# EAGLE design TF (EAGLE 6.4)
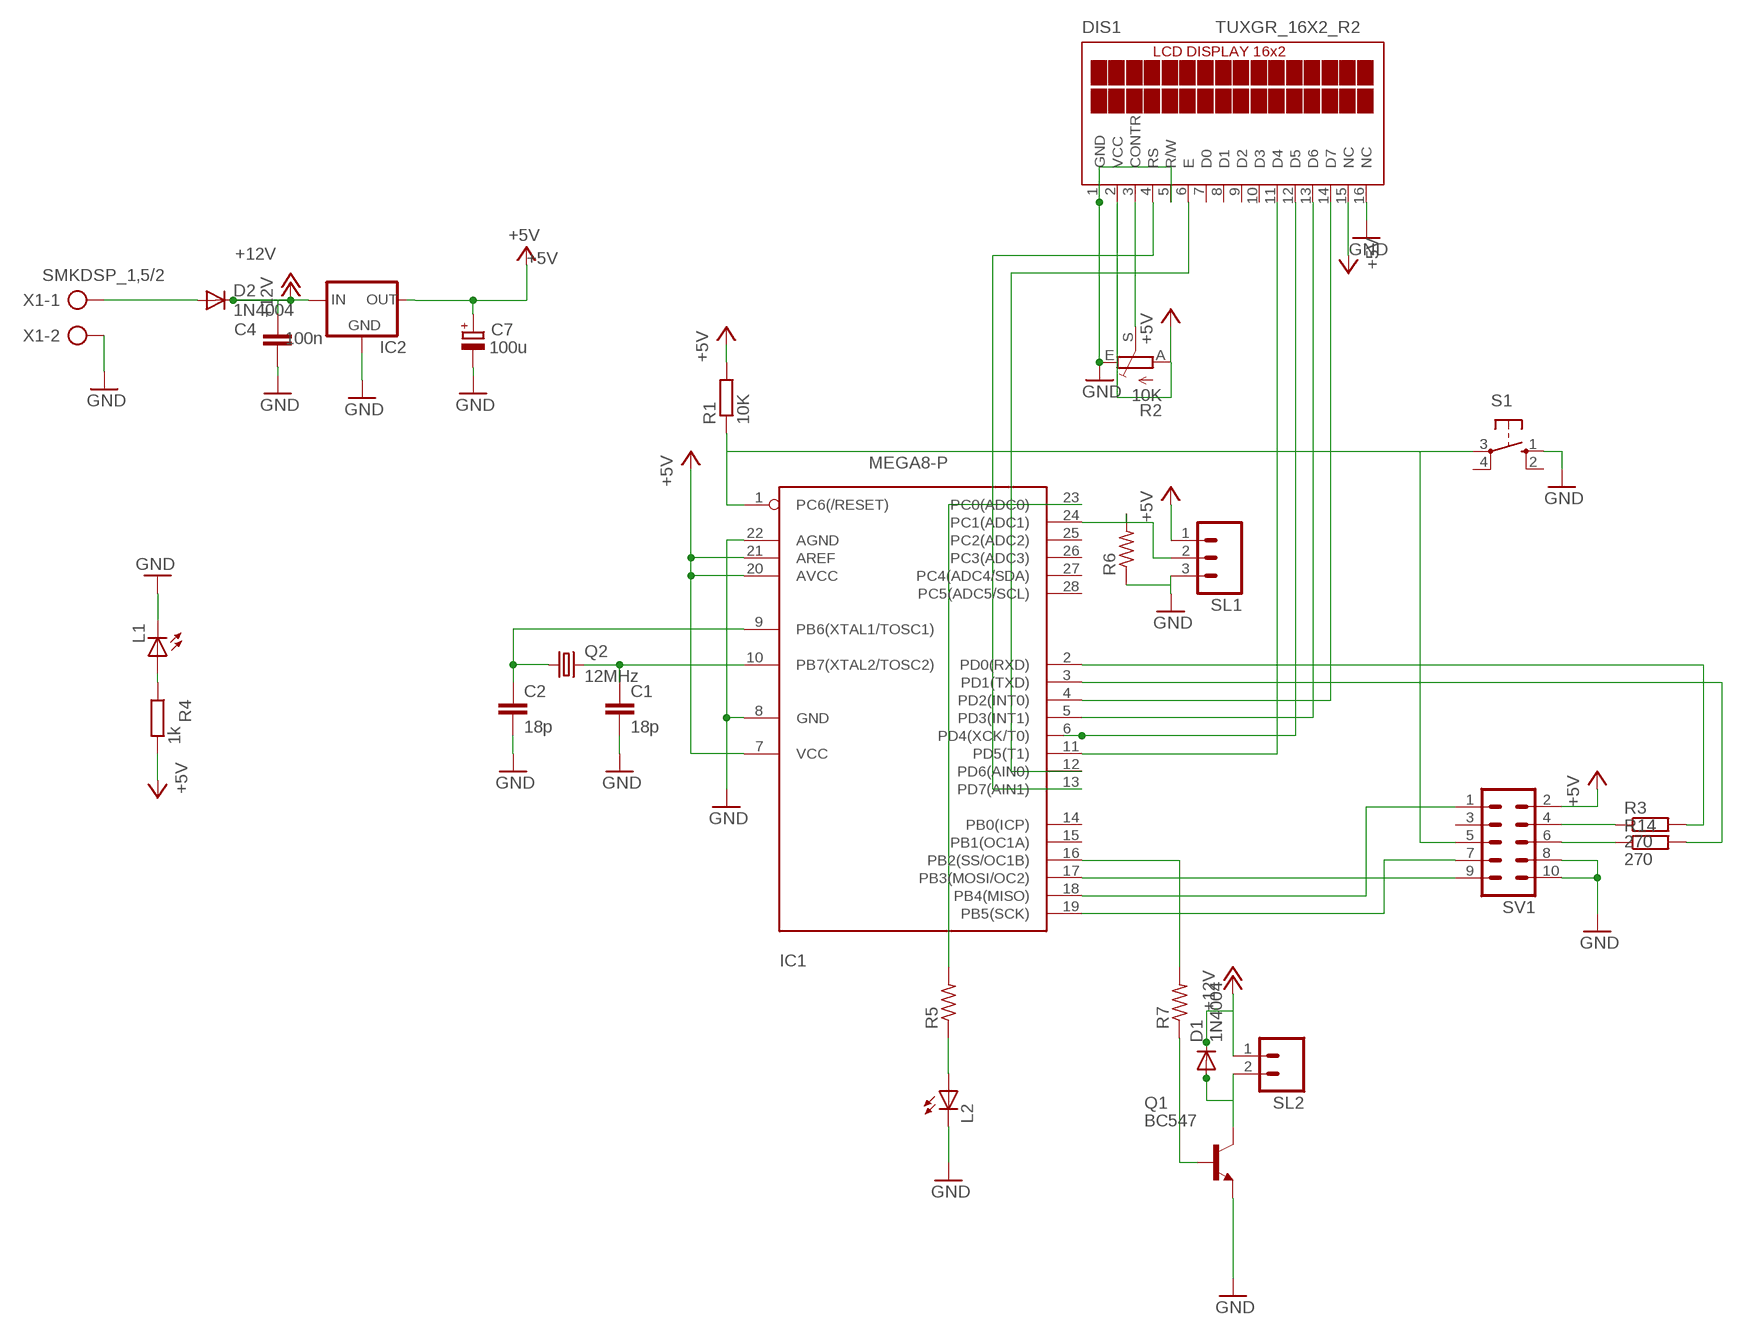
[diagram p0: schematic, sheet 1]

## Parts
C1  18p  C-EU025-024X044  [C025-024X044]
C2  18p  C-EU025-024X044  [C025-024X044]
C4  100n  C-EU025-030X050  [C025-030X050]
C7  100u  CPOL-EUE3.5-8  [E3,5-8]
D1  1N4004  [DO41-10]
D2  1N4004  [DO41-10]
DIS1  TUXGR_16X2_R2  [TUXGR_16X2_R2]
IC1  MEGA8-P  [DIL28-3]
IC2  78XXS  [78XXS]
L1  LED5MM  [LED5MM]
L2  LED5MM  [LED5MM]
Q1  BC547  [TO92]
Q2  12MHz  CRYTALHC49S  [HC49/S]
R1  10K  R-EU_0207/10  [0207/10]
R2  10K  TRIM_EU-CA6V  [CA6V]
R3  270  R-EU_0207/10  [0207/10]
R4  1k  R-EU_0207/10  [0207/10]
R5  R-US_0207/10  [0207/10]
R6  R-US_0207/10  [0207/10]
R7  R-US_0207/10  [0207/10]
R14  270  R-EU_0207/10  [0207/10]
S1  10-XX  [B3F-10XX]
SL1  M03  [03P]
SL2  M02  [02P]
SV1  ML10  [ML10]
X1  SMKDSP_1,5/2  [SMKDSP_1,5/2]

## Nets
+5V: C7.+ DIS1.2(VCC) DIS1.15(NC) IC1.7(VCC) IC1.20(AVCC) IC1.21(AREF) IC2.OUT R1.2 R2.A R4.2 SL1.1 SV1.2
+12V [power]: C4.2 D1.C D2.C IC2.IN SL2.1
GND: C1.2 C2.2 C4.1 C7.- DIS1.1(GND) DIS1.5(R/W) DIS1.16(NC) IC1.8(GND) IC1.22(AGND) IC2.GND L1.K(C) L2.K(C) Q1.1(E) R2.E R6.1 S1.1(S) SL1.3 SV1.8 SV1.10 X1.2
N$1: L1.A R4.1
N$2: DIS1.6(E) IC1.12(PD6(AIN0))
N$3: C1.1 IC1.10(PB7(XTAL2/TOSC2)) Q2.2
N$4: C2.1 IC1.9(PB6(XTAL1/TOSC1)) Q2.1
N$5: DIS1.3(CONTR) R2.S
N$6: R3.1 SV1.4
N$7: IC1.2(PD0(RXD)) R3.2
N$8: D1.A Q1.3(C) SL2.2
N$9: DIS1.13(D6) IC1.5(PD3(INT1))
N$10: DIS1.14(D7) IC1.4(PD2(INT0))
N$11: IC1.18(PB4(MISO)) SV1.1
N$12: DIS1.12(D5) IC1.6(PD4(XCK/T0))
N$13: IC1.1(PC6(/RESET)) R1.1 S1.3(P) SV1.5
N$14: DIS1.11(D4) IC1.11(PD5(T1))
N$15: IC1.17(PB3(MOSI/OC2)) SV1.9
N$16: L2.A R5.1
N$17: IC1.16(PB2(SS/OC1B)) R7.2
N$18: IC1.23(PC0(ADC0)) R5.2
N$19: IC1.24(PC1(ADC1)) R6.2 SL1.2
N$21: D2.A X1.1
N$25: IC1.3(PD1(TXD)) R14.2
N$27: R14.1 SV1.6
N$28: DIS1.4(RS) IC1.13(PD7(AIN1))
N$32: Q1.2(B) R7.1
N$34: IC1.19(PB5(SCK)) SV1.7
Unconnected: DIS1.7(D0) DIS1.8(D1) DIS1.9(D2) DIS1.10(D3) IC1.14(PB0(ICP)) IC1.15(PB1(OC1A)) IC1.25(PC2(ADC2)) IC1.26(PC3(ADC3)) IC1.27(PC4(ADC4/SDA)) IC1.28(PC5(ADC5/SCL)) S1.2(S1) S1.4(P1) SV1.3

## Library data of the parts
C1 C2 = rcl:C-EU: CAPACITOR, European symbol
C4 = resistor:C-EU: CAPACITOR, European symbol
C7 = resistor:CPOL-EU: POLARIZED CAPACITOR, European symbol
D1 D2 = diode:1N4004: DIODE general purpose rectifier, 1 A
DIS1 = display-lcd:TUXGR_16X2_R2: Tuxgraphics LCD display 16x2 characters reflective, without background light Source: tuxgr_12x2_r2.pdf; OC_FARNELL: unknown; OC_NEWARK: unknown
IC1 = atmel:MEGA8-P: MICROCONTROLLER 8 Kbytes FLASH 1 kbytes SRAM 512 bytes EEPROM USART 4-channel 10 bit ADC 2-channel 8 bit ADC Source: avr.lbr
IC2 = v-reg:78XXS: VOLTAGE REGULATOR
L1 L2 = led:LED: LED OSRAM: - CHIPLED LG R971, LG N971, LY N971, LG Q971, LY Q971, LO R971, LY R971 LH N974, LH R974 LS Q976, LO Q976, LY Q976 LO Q996 - Hyper CHIPLED LW Q18S LB Q993, LB Q99A, LB R99A - SideLED LS A670, LO A670, LY A670, LG A670, LP A670 LB A673, LV A673, LT A673, LW A673 LH A674 LY A675 LS A676, LA A676, LO A676, LY A676, LW A676 LS A679, LY A679, LG A679 - Hyper Micro SIDELED® LS Y876, LA Y876, LO Y876, LY Y876 LT Y87S - SmartLED LW L88C, LW L88S LB L89C, LB L89S, LG L890 LS L89K, LO L89K, LY L89K LS L896, LA L896, LO L896, LY L896 - TOPLED LS T670, LO T670, LY T670, LG T670, LP T670 LSG T670, LSP T670, LSY T670, LOP T670, LYG T670 LG T671, LOG T671, LSG T671 LB T673, LV T673, LT T673, LW T673 LH T674 LS T676, LA T676, LO T676, LY T676, LB T676, LH T676, LSB T676, LW T676 LB T67C, LV T67C, LT T67C, LS T67K, LO T67K, LY T67K, LW E67C LS E67B, LA E67B, LO E67B, LY E67B, LB E67C, LV E67C, LT E67C LW T67C LS T679, LY T679, LG T679 LS T770, LO T770, LY T770, LG T770, LP T770 LB T773, LV T773, LT T773, LW T773 LH T774 LS E675, LA E675, LY E675, LS T675 LS T776, LA T776, LO T776, LY T776, LB T776 LHGB T686 LT T68C, LB T68C - Hyper Mini TOPLED® LB M676 - Mini TOPLED Santana® LG M470 LS M47K, LO M47K, LY M47K Source: http://www.osram.convergy.de LUXEON: - LUMILED® LXK2-PW12-R00, LXK2-PW12-S00, LXK2-PW14-U00, LXK2-PW14-V00 LXK2-PM12-R00, LXK2-PM12-S00, LXK2-PM14-U00 LXK2-PE12-Q00, LXK2-PE12-R00, LXK2-PE12-S00, LXK2-PE14-T00, LXK2-PE14-U00 LXK2-PB12-K00, LXK2-PB12-L00, LXK2-PB12-M00, LXK2-PB14-N00, LXK2-PB14-P00, LXK2-PB14-Q00 LXK2-PR12-L00, LXK2-PR12-M00, LXK2-PR14-Q00, LXK2-PR14-R00 LXK2-PD12-Q00, LXK2-PD12-R00, LXK2-PD12-S00 LXK2-PH12-R00, LXK2-PH12-S00 LXK2-PL12-P00, LXK2-PL12-Q00, LXK2-PL12-R00 Source: www.luxeon.com KINGBRIGHT: KA-3528ASYC Source: www.kingbright.com
Q1 = transistor-npn:BC547*: NPN Transistor
Q2 = crystal:CRYTAL: CRYSTAL
R1 R4 = resistor:R-EU_: RESISTOR, European symbol
R2 = pot:TRIM_EU-: POTENTIOMETER
R3 R14 = rcl:R-EU_: RESISTOR, European symbol
R5-R7 = resistor:R-US_: RESISTOR, American symbol
S1 = switch-omron:10-XX: OMRON SWITCH; MPN: B3F-1000; OC_FARNELL: 176432; OC_NEWARK: 36M3542
SL1 = con-amp-quick:M03: AMP QUICK CONNECTOR; OC_FARNELL: unknown; OC_NEWARK: unknown
SL2 = con-amp-quick:M02: AMP QUICK CONNECTOR; OC_FARNELL: unknown; OC_NEWARK: unknown
SV1 = con-harting-ml:ML10: HARTING
X1 = con-phoenix-smkdsp:SMKDSP_1,5/2: Printklemme, Nennstrom: 17,5 A, Bemessungsspannung: 250 V, Raster: 5,0 mm Source: http://eshop.phoenixcontact.de .. 1733415.pdf; MF: FARNELL; MPN: 1733570; OC_FARNELL: 3041244; OC_NEWARK: 69C8588

## Net classes
1 power: width 0.61 mm, drill 0.508 mm, clearance 0.152 mm
2 gnd: width 0.305 mm, drill 0.508 mm, clearance 0.152 mm
3 usbvcc: width 0.508 mm, drill 0.508 mm, clearance 0.152 mm

## Board
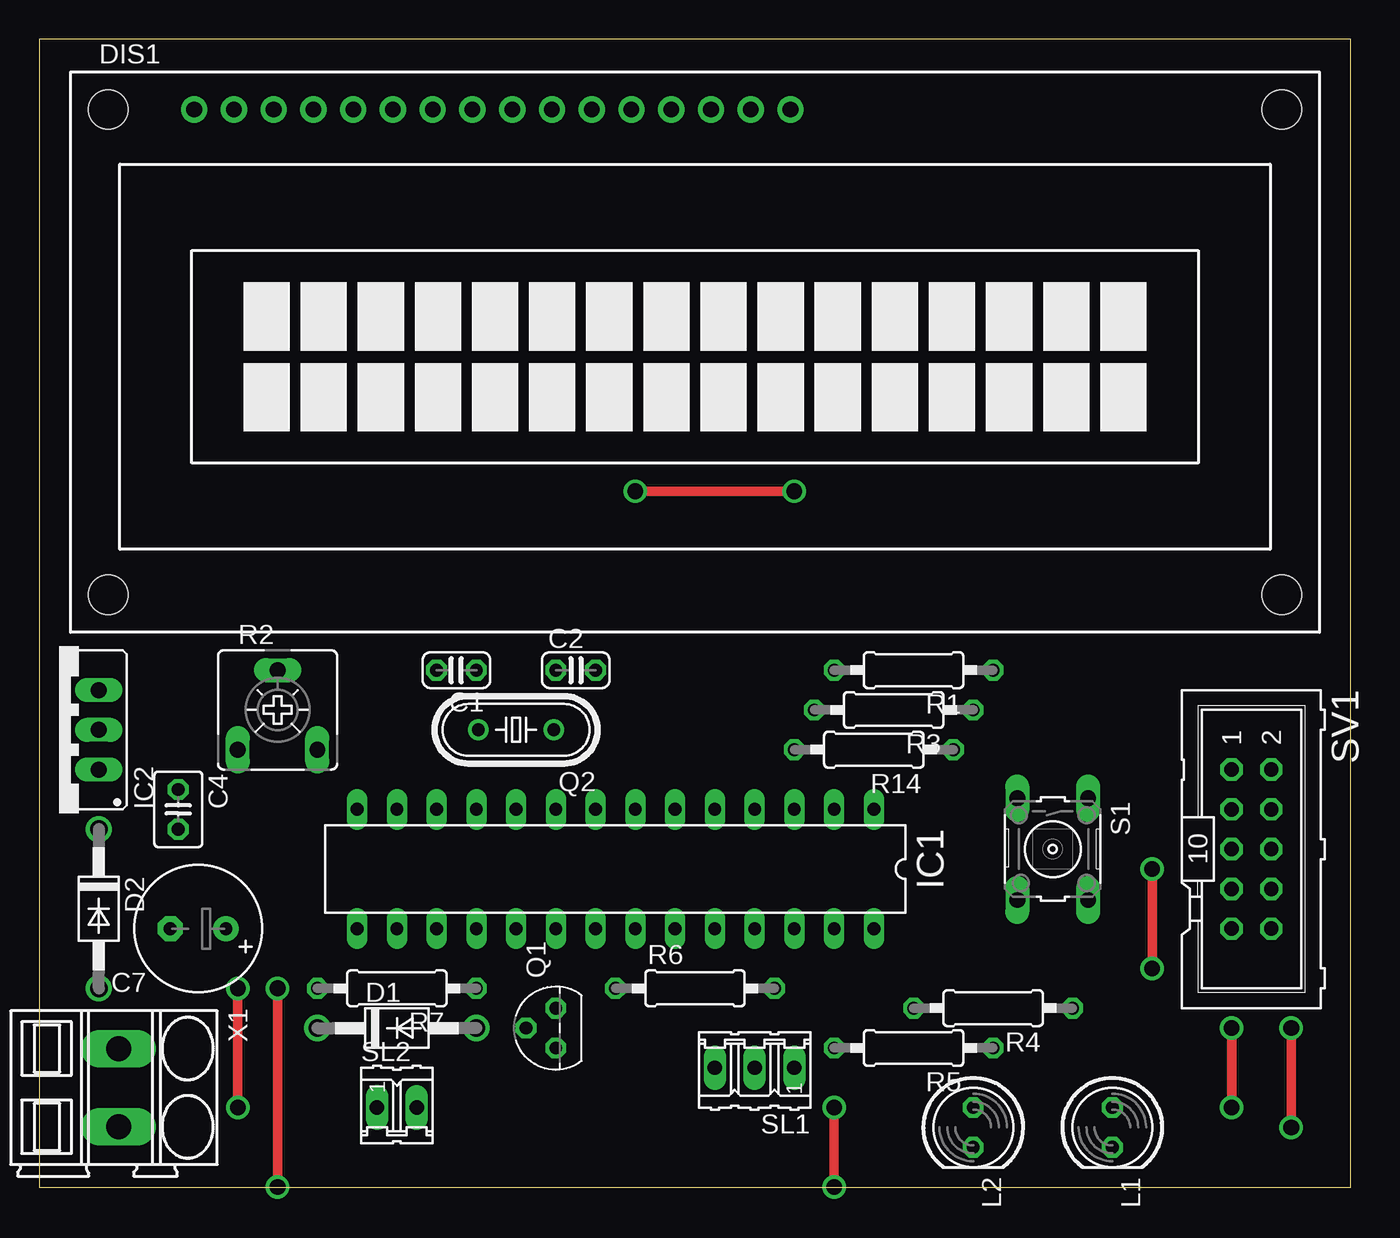
[diagram p1: board, top side]
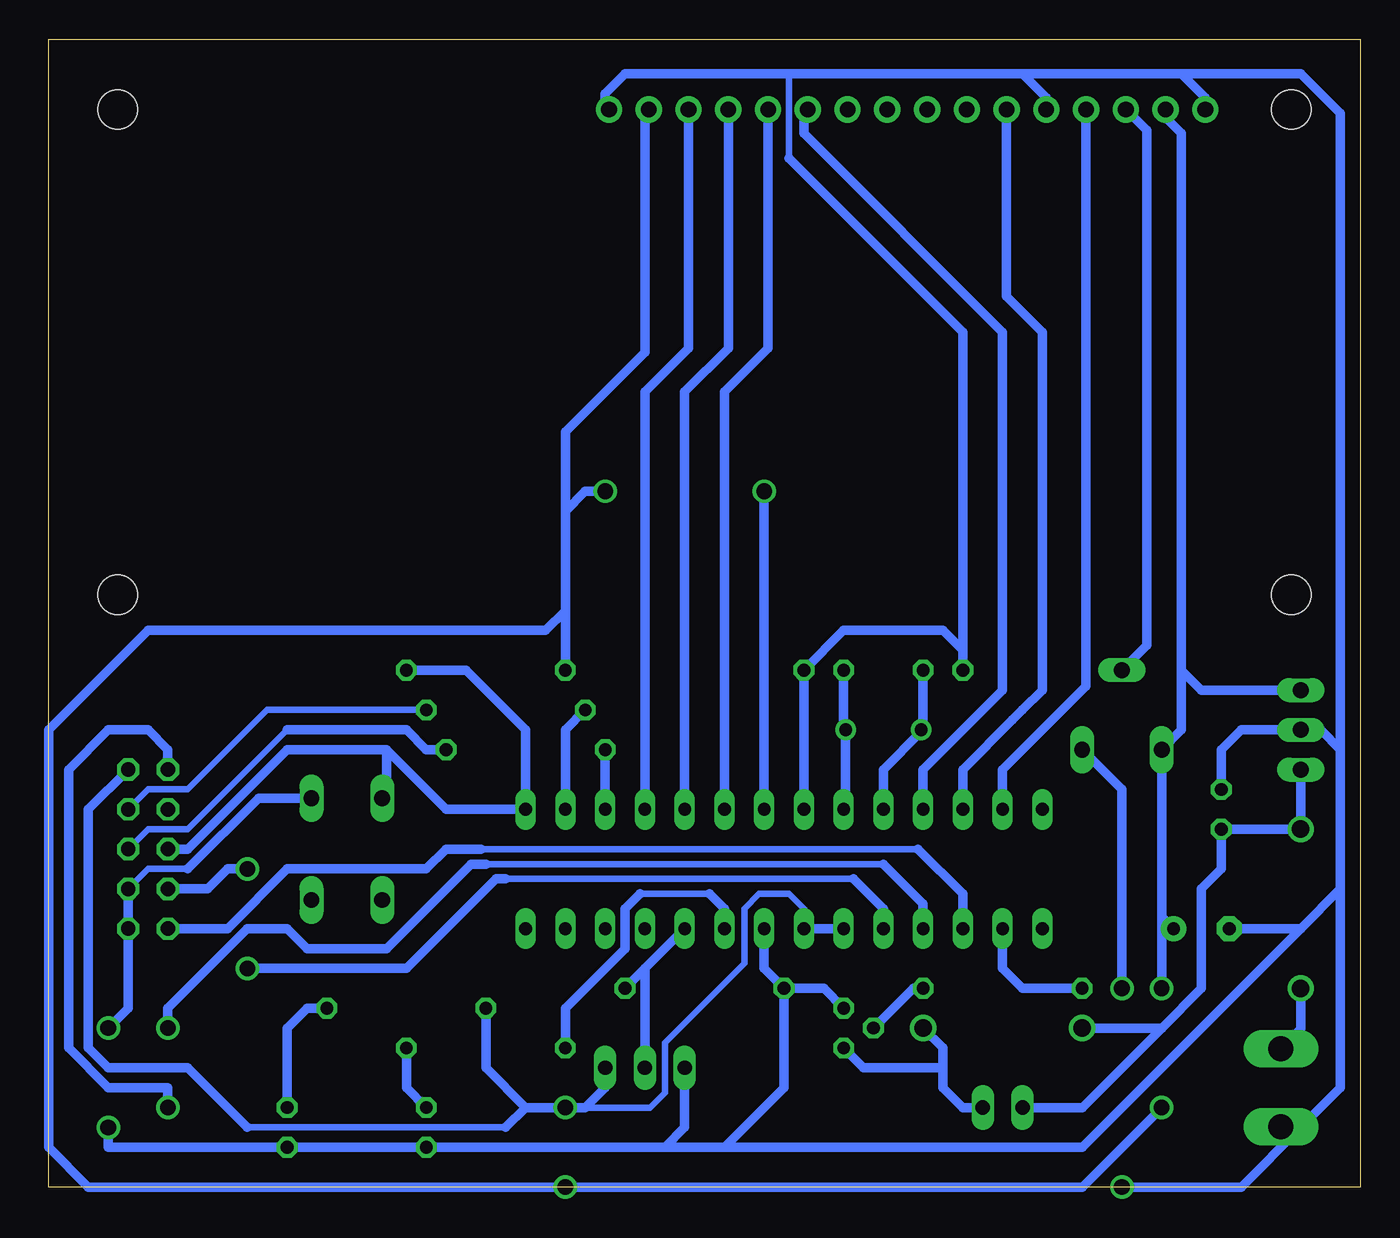
[diagram p2: board, bottom side, seen from below]

Size 83.8 x 73.33 mm. Coordinates in mm from the lower left corner, seen from the top.
Outline: 0,0 83.8,0 83.8,73.33 0,73.33 0,0
Copper layers (1*16): Top 0.035mm / dielectric 1.5mm / Bottom 0.035mm
Design rules "default": minimum track width 10mil, minimum drill 24mil, track to track 8mil, track to pad 8mil, pad to pad 8mil, via to via 8mil, smd to smd 8mil, copper to edge 40mil, drill to drill 8mil, minimum pad ring 10mil, minimum via ring 8mil, stop-mask expansion 4mil, vias tented up to drill 0mil, thermal gap 10mil

### Footprints (pad centres in the part's own frame; a part is rotated, then mirrored left to right if it is on the bottom)
C025-024X044 = drill 0.813 octagon: 1 -1.27,0; 2 1.27,0
C025-030X050 = drill 0.813 octagon: 1 -1.27,0; 2 1.27,0
E3,5-8 = drill 0.813 pad 1.6: + -1.778,0 | drill 0.813 pad 1.6 octagon: - 1.778,0
DO41-10 = drill 1.118: A 5.08,0; C -5.08,0
TUXGR_16X2_R2 = drill 1 pad 1.676: 1 -32,15.5; 2 -29.46,15.5; 3 -26.92,15.5; 4 -24.38,15.5; 5 -21.84,15.5; 6 -19.3,15.5; 7 -16.76,15.5; 8 -14.22,15.5; 9 -11.68,15.5; 10 -9.14,15.5; 11 -6.6,15.5; 12 -4.06,15.5; 13 -1.52,15.5; 14 1.02,15.5; 15 3.56,15.5; 16 6.1,15.5 | hole 2.5: -37.5,-15.5; 37.5,-15.5; -37.5,15.5; 37.5,15.5
DIL28-3 = drill 0.813 long: 1 -16.51,-3.81; 2 -13.97,-3.81; 3 -11.43,-3.81; 4 -8.89,-3.81; 5 -6.35,-3.81; 6 -3.81,-3.81; 7 -1.27,-3.81; 8 1.27,-3.81; 9 3.81,-3.81; 10 6.35,-3.81; 11 8.89,-3.81; 12 11.43,-3.81; 13 13.97,-3.81; 14 16.51,-3.81; 15 16.51,3.81; 16 13.97,3.81; 17 11.43,3.81; 18 8.89,3.81; 19 6.35,3.81; 20 3.81,3.81; 21 1.27,3.81; 22 -1.27,3.81; 23 -3.81,3.81; 24 -6.35,3.81; 25 -8.89,3.81; 26 -11.43,3.81; 27 -13.97,3.81; 28 -16.51,3.81
78XXS = drill 1.016 long: GND 0,-2.54; IN -2.54,-2.54; OUT 2.54,-2.54
LED5MM = drill 0.813 octagon: A -1.27,0; K 1.27,0
TO92 = drill 0.813 octagon: 1 1.27,0; 2 0,1.905; 3 -1.27,0
HC49/S = drill 0.813: 1 -2.413,0; 2 2.413,0
0207/10 = drill 0.813 octagon: 1 -5.08,0; 2 5.08,0
CA6V = drill 1.016 long: A -2.54,-2.54; E 2.54,-2.54; S 0,2.54
B3F-10XX = drill 1.016 long: 1 -3.251,2.261; 2 3.251,2.261; 3 -3.251,-2.261; 4 3.251,-2.261
03P = drill 0.914 long: 1 -2.54,0; 2 0,0; 3 2.54,0
02P = drill 0.914 long: 1 -1.27,0; 2 1.27,0
ML10 = drill 0.914 octagon: 1 -5.08,-1.27; 2 -5.08,1.27; 3 -2.54,-1.27; 4 -2.54,1.27; 5 0,-1.27; 6 0,1.27; 7 2.54,-1.27; 8 2.54,1.27; 9 5.08,-1.27; 10 5.08,1.27
SMKDSP_1,5/2 = drill 1.6 pad 1.8 long: 1 -2.5,0; 2 2.5,0

### Placement (x,y rotation side)
C1  26.67,33.02 180 top
C2  34.29,33.02 0 top
C4  8.89,24.13 270 top
C7  10.16,16.51 180 top
D1  22.86,10.16 0 top
D2  3.81,17.78 270 top
DIS1  41.91,53.34 0 top
IC1  36.83,20.32 180 top
IC2  1.27,29.21 90 top
L1  68.58,3.81 270 top
L2  59.69,3.81 270 top
Q1  33.02,10.16 90 top
Q2  30.48,29.21 180 top
R1  55.88,33.02 180 top
R2  15.24,30.48 0 top
R3  54.61,30.48 180 top
R4  60.96,11.43 180 top
R5  55.88,8.89 180 top
R6  41.91,12.7 0 top
R7  22.86,12.7 180 top
R14  53.34,27.94 180 top
S1  64.77,21.59 270 top
SL1  45.72,7.62 180 top
SL2  22.86,5.08 0 top
SV1  77.47,21.59 270 top
X1  5.08,6.35 270 top

### Tracks (layer width: path | path; a pad name or v marks a point on that pad's centre or on a via)
+5V  (via drill 1)
  Top 0.61: v38.1,44.45 v48.26,44.45 | v12.7,12.7 v12.7,5.08 | v50.8,5.08 v50.8,0
  Bottom 0.406: 54.61,3.81 71.12,3.81 | IC1.21 35.56,17.78 36.51,18.73 38.42,18.73 39.37,17.78 39.37,14.29 44.45,9.21 44.45,6.03 45.4,5.08 49.53,5.08
  Bottom 0.61: DIS1.2 12.45,68.33 11.43,67.31 11.43,33.02 | R1.2 50.8,36.83 | 50.8,36.83 50.8,43.18 | 50.8,43.18 50.8,48.26 45.72,53.34 45.72,68.59 DIS1.15 | 11.43,33.02 11.43,29.21 R2.A 12.7,17.27 | 12.7,17.27 C7.+ | IC2.OUT 10.16,31.75 11.43,33.02 | SL1.1 48.26,6.35 49.53,5.08 v50.8,5.08 53.34,5.08 | 53.34,5.08 55.88,7.62 R4.2 | SV1.2 81.28,24.13 81.28,8.89 80.01,7.62 74.93,7.62 71.12,3.81 | 54.61,3.81 53.34,5.08 | IC1.20 IC1.21 | IC1.7 v38.1,44.45 | v48.26,44.45 49.53,44.45 50.8,43.18 | 12.7,17.27 v12.7,12.7 | v12.7,5.08 17.78,0 v50.8,0 81.28,0 83.82,2.54 83.82,29.21 77.47,35.56 52.07,35.56 50.8,36.83
+12V
  Bottom 0.61: IC2.IN D2.C C4.2 8.89,20.32 10.16,19.05 10.16,12.7 12.7,10.16 | D1.C 12.7,10.16 | 12.7,10.16 17.78,5.08 SL2.1
GND  (via drill 1)
  Top 0.61: v80.01,10.16 v80.01,3.81 | v15.24,12.7 v15.24,0
  Bottom 0.406: 74.93,20.32 77.47,20.32 SV1.8 | 36.51,65.72 36.51,71.12
  Bottom 0.61: 21.59,71.12 36.51,71.12 46.99,71.12 48.26,69.85 48.26,69.09 DIS1.16 | DIS1.1 9.91,69.6 11.43,71.12 | 11.43,71.12 21.59,71.12 | IC1.8 C2.2 33.02,35.56 26.67,35.56 25.4,34.29 | C4.1 8.89,27.94 7.62,29.21 IC2.GND 2.54,29.21 1.27,27.94 | C7.- 3.81,16.51 | 1.27,19.05 1.27,27.94 | 3.81,16.51 1.27,19.05 | 1.27,19.05 1.27,6.35 3.81,3.81 | 3.81,3.81 5.04,3.81 X1.2 | Q1.1 34.29,12.7 R6.1 | 40.64,2.54 44.45,2.54 | 44.45,2.54 L2.K L1.K 80.01,2.54 v80.01,3.81 | SL1.3 43.18,3.81 44.45,2.54 | SV1.8 SV1.10 78.74,11.43 v80.01,10.16 | S1.1 70.41,24.84 74.93,20.32 | DIS1.5 20.07,69.6 21.59,71.12 | 11.43,71.12 3.81,71.12 1.27,68.58 1.27,27.94 | C1.2 25.4,34.29 | 25.4,34.29 25.4,54.61 36.51,65.72 | R2.E 15.24,25.4 v15.24,12.7 | v15.24,0 7.62,0 3.81,3.81 | 38.1,16.83 IC1.22 38.1,13.97 R6.1 | R6.1 36.83,6.35 40.64,2.54 | 40.64,2.54 17.78,2.54 3.81,16.51
N$1
  Bottom 0.61: R4.1 67.31,11.43 68.58,10.16 L1.A
N$2
  Bottom 0.61: IC1.12 25.4,26.67 22.23,29.84 21.59,30.48 20.32,31.75 20.32,54.61 22.61,56.9 DIS1.6
N$3
  Bottom 0.61: C1.1 27.94,29.34 Q2.2 28.07,29.08 30.48,26.67 IC1.10
N$4
  Bottom 0.61: C2.1 33.02,29.34 Q2.1 32.89,24.26 IC1.9
N$5
  Bottom 0.61: R2.S 13.65,34.61 13.65,67.5 DIS1.3
N$6
  Bottom 0.406: R3.1 69.85,30.48 74.93,25.4 77.47,25.4 SV1.4
N$7
  Bottom 0.61: R3.2 50.8,29.21 IC1.2
N$8
  Bottom 0.61: SL2.2 25.4,5.08 26.67,6.35 26.67,7.62 | D1.A 26.67,8.89 26.67,7.62 | 26.67,7.62 31.75,7.62 Q1.3
N$9
  Bottom 0.61: DIS1.13 40.39,53.59 43.18,50.8 IC1.5
N$10
  Bottom 0.61: DIS1.14 42.93,53.59 45.72,50.8 IC1.4
N$11  (via drill 1)
  Top 0.61: v76.2,5.08 v76.2,10.16
  Bottom 0.406: 30.48,20.64 55.88,20.64
  Bottom 0.61: IC1.18 27.94,18.1 30.48,20.64 | 55.88,20.64 56.83,20.64 62.23,15.24 67.31,15.24 68.58,16.51 71.12,16.51 76.2,11.43 v76.2,10.16 | SV1.1 76.2,27.94 77.47,29.21 80.01,29.21 82.55,26.67 82.55,8.89 80.01,6.35 76.2,6.35 v76.2,5.08
N$12
  Bottom 0.61: DIS1.12 37.85,53.59 40.64,50.8 IC1.6
N$13
  Bottom 0.61: SV1.5 74.93,21.59 68.58,27.94 62.23,27.94 | 62.23,27.94 58.42,24.13 IC1.1 53.34,29.21 57.15,33.02 R1.1 | 62.23,27.94 62.23,23.85 S1.3
N$14
  Bottom 0.61: IC1.11 27.94,26.67 22.86,31.75 22.86,54.61 35.56,67.31 35.56,68.59 DIS1.11
N$15
  Bottom 0.406: 28.26,21.59 56.2,21.59
  Bottom 0.61: IC1.17 25.4,18.73 28.26,21.59 | 56.2,21.59 58.42,21.59 59.69,20.32 68.58,20.32 72.39,16.51 SV1.9
N$16
  Bottom 0.61: L2.A 60.96,6.35 R5.1
N$17
  Bottom 0.61: R7.2 21.59,12.7 22.86,13.97 IC1.16
N$18
  Bottom 0.406: 41.59,18.73 46.04,18.73
  Bottom 0.61: R5.2 50.8,11.43 46.99,15.24 46.99,17.78 46.04,18.73 | 41.59,18.73 40.64,17.78 IC1.23
N$19
  Bottom 0.61: R6.2 45.72,13.97 | 45.72,13.97 IC1.24 | SL1.2 45.72,13.97
N$21
  Bottom 0.61: D2.A 3.81,10.12 X1.1
N$25
  Bottom 0.61: IC1.3 R14.2
N$27
  Bottom 0.406: 68.58,29.21 74.93,22.86 77.47,22.86 SV1.6
  Bottom 0.61: R14.1 59.69,27.94 60.96,29.21 68.58,29.21
N$28
  Bottom 0.61: IC1.13 22.86,26.67 17.53,32 DIS1.4
N$32
  Bottom 0.61: R7.1 28.58,12.7 Q1.2
N$34  (via drill 1)
  Top 0.61: v71.12,13.97 v71.12,20.32
  Bottom 0.406: 32.39,19.69 54.61,19.69
  Bottom 0.61: IC1.19 30.48,17.78 32.39,19.69 | 54.61,19.69 55.25,19.69 60.96,13.97 v71.12,13.97 | v71.12,20.32 72.39,20.32 73.66,19.05 SV1.7